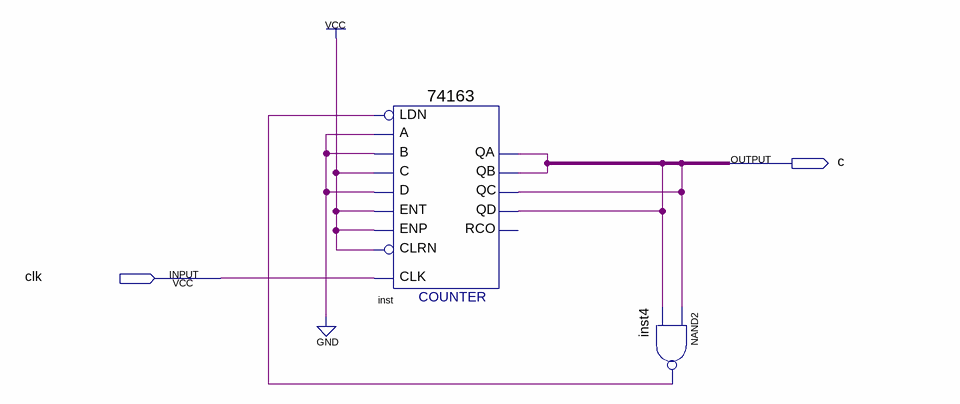
[diagram p0: schematic sheet]
// Quartus schematic Specialcount4_12.bdf as structural Verilog: 2 symbols, 2 pins
module Specialcount4_12 (
  input  clk,
  output c
);

  wire inst4_out;

  \74163  inst (
    .C(1'b1), .B(1'b0), .A(1'b0), .ENT(1'b1), .D(1'b0), .CLRN(1'b1), .CLK(clk), .ENP(1'b1), .LDN(inst4_out),
    .QA(c), .QB(c), .QC(c), .QD(c));  // open: RCO
  nand inst4 (inst4_out, c, c);
endmodule
